# EAGLE design time_circuits1.3 (EAGLE 9.6.2)
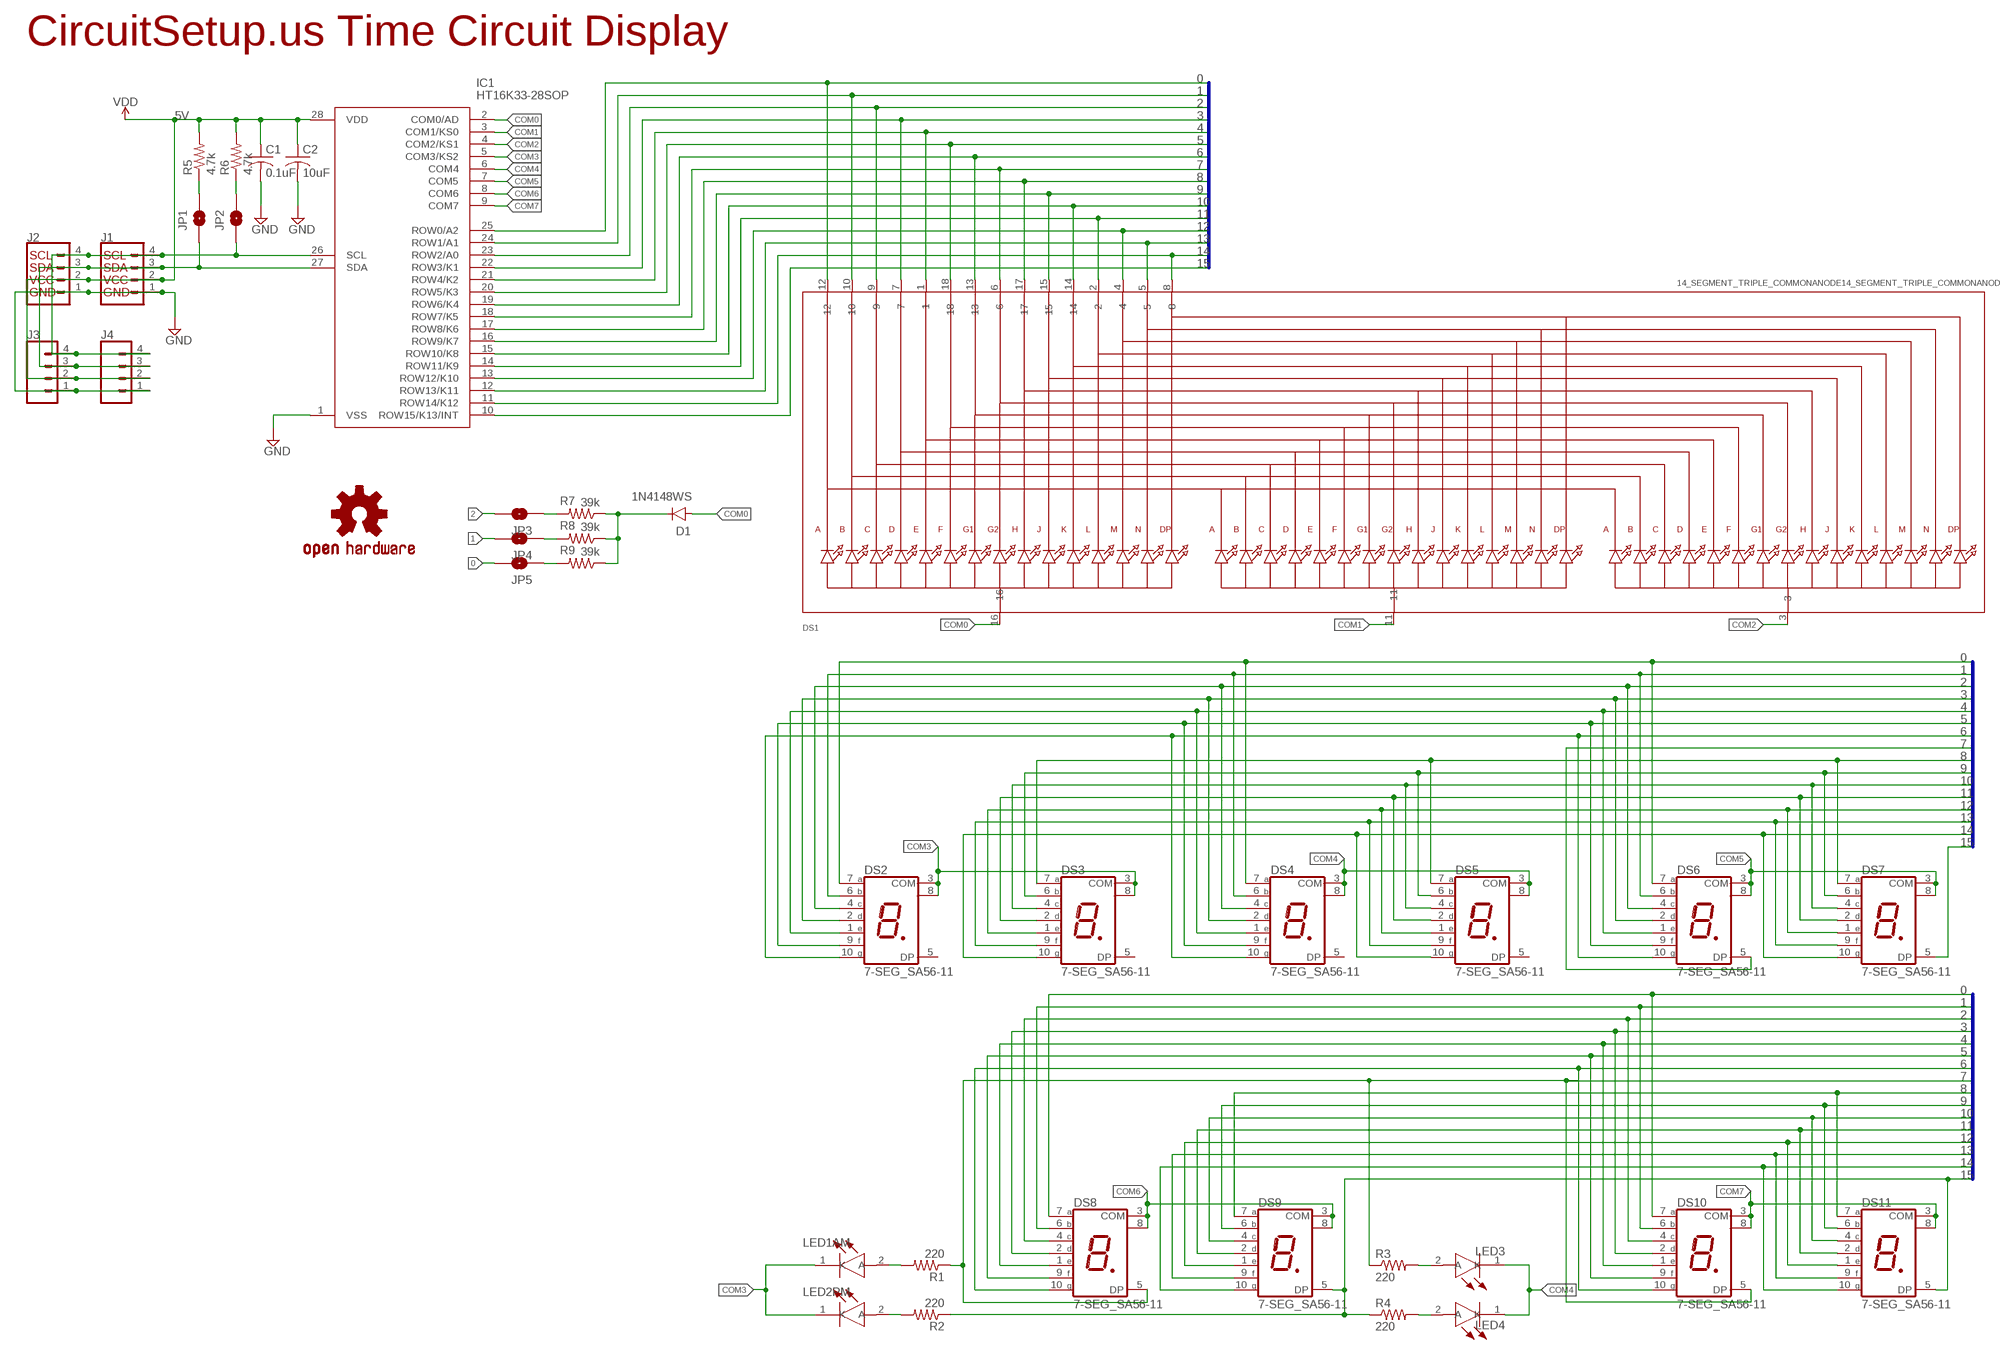
[diagram p0: schematic, sheet 1]

## Parts
C1  0.1uF  C-USC0603  [C0603]
C2  10uF  C-USC0603  [C0603]
D1  1N4148WS  [SOD-323]
DS1  14_SEGMENT_TRIPLE_COMMONANODE14_SEGMENT_TRIPLE_COMMONANODE  [SEGMENT_TRIPLE_14]
DS2  7-SEG_SA56-11  [SA56-11]
DS3  7-SEG_SA56-11  [SA56-11]
DS4  7-SEG_SA56-11  [SA56-11]
DS5  7-SEG_SA56-11  [SA56-11]
DS6  7-SEG_SA56-11  [SA56-11]
DS7  7-SEG_SA56-11  [SA56-11]
DS8  7-SEG_SA56-11  [SA56-11]
DS9  7-SEG_SA56-11  [SA56-11]
DS10  7-SEG_SA56-11  [SA56-11]
DS11  7-SEG_SA56-11  [SA56-11]
IC1  HT16K33-28SOP  [SOIC127P1031X264-28N]
J1  I2C_STANDARD  [1X04]
J2  I2C_STANDARD  [1X04]
J3  CONN_04SMD_2.54  [1X04_5.5MM_STRAIGHT]
J4  CONN_04SMD_2.54  [1X04_5.5MM_STRAIGHT]
JP1  JUMPER-SMT_2_NO_SILK  [SMT-JUMPER_2_NO_SILK]
JP2  JUMPER-SMT_2_NO_SILK  [SMT-JUMPER_2_NO_SILK]
JP3  JUMPER-SMT_2_NO_SILK  [SMT-JUMPER_2_NO_SILK]
JP4  JUMPER-SMT_2_NO_SILK  [SMT-JUMPER_2_NO_SILK]
JP5  JUMPER-SMT_2_NO_SILK  [SMT-JUMPER_2_NO_SILK]
LED1AM  WP132XGD  [WP132XGD]
LED2PM  WP132XGD  [WP132XGD]
LED3  WP132XGD  [WP132XGD]
LED4  WP132XGD  [WP132XGD]
LOGO1  OSHW-LOGOL  [OSHW-LOGO-L]
R1  220  R-US_R0603  [R0603]
R2  220  R-US_R0603  [R0603]
R3  220  R-US_R0603  [R0603]
R4  220  R-US_R0603  [R0603]
R5  4.7k  R-US_R0603  [R0603]
R6  4.7k  R-US_R0603  [R0603]
R7  39k  R-US_R0603  [R0603]
R8  39k  R-US_R0603  [R0603]
R9  39k  R-US_R0603  [R0603]

## Nets
0: DS1.12 DS2.7(A) DS4.7(A) DS6.7(A) DS8.7(A) DS10.7(A) IC1.25(ROW0/A2) JP5.2
1: DS1.10 DS2.6(B) DS4.6(B) DS6.6(B) DS8.6(B) DS10.6(B) IC1.24(ROW1/A1) JP4.2
2: DS1.9 DS2.4(C) DS4.4(C) DS6.4(C) DS8.4(C) DS10.4(C) IC1.23(ROW2/A0) JP3.2
3: DS1.7 DS2.2(D) DS4.2(D) DS6.2(D) DS8.2(D) DS10.2(D) IC1.22(ROW3/K1)
4: DS1.1 DS2.1(E) DS4.1(E) DS6.1(E) DS8.1(E) DS10.1(E) IC1.21(ROW4/K2)
5: DS1.18 DS2.9(F) DS4.9(F) DS6.9(F) DS8.9(F) DS10.9(F) IC1.20(ROW5/K3)
5V: C1.1 C2.1 IC1.28(VDD) J1.2 J2.2 J3.2 J4.2 R5.2 R6.2 ; supply symbol labelled VDD
6: DS1.13 DS2.10(G) DS4.10(G) DS6.10(G) DS8.10(G) DS10.10(G) IC1.19(ROW6/K4)
7: DS1.6 DS6.5(DP) DS8.5(DP) DS10.5(DP) IC1.18(ROW7/K5) R1.1 R3.1
8: DS1.17 DS3.7(A) DS5.7(A) DS7.7(A) DS9.7(A) DS11.7(A) IC1.17(ROW8/K6)
9: DS1.15 DS3.6(B) DS5.6(B) DS7.6(B) DS9.6(B) DS11.6(B) IC1.16(ROW9/K7)
10: DS1.14 DS3.4(C) DS5.4(C) DS7.4(C) DS9.4(C) DS11.4(C) IC1.15(ROW10/K8)
11: DS1.2 DS3.2(D) DS5.2(D) DS7.2(D) DS9.2(D) DS11.2(D) IC1.14(ROW11/K9)
12: DS1.4 DS3.1(E) DS5.1(E) DS7.1(E) DS9.1(E) DS11.1(E) IC1.13(ROW12/K10)
13: DS1.5 DS3.9(F) DS5.9(F) DS7.9(F) DS9.9(F) DS11.9(F) IC1.12(ROW13/K11)
14: DS1.8 DS3.10(G) DS5.10(G) DS7.10(G) DS9.10(G) DS11.10(G) IC1.11(ROW14/K12)
15: DS7.5(DP) DS9.5(DP) DS11.5(DP) IC1.10(ROW15/K13/INT) R2.1 R4.1
COM0: D1.A DS1.16 IC1.2(COM0/AD)
COM1: DS1.11 IC1.3(COM1/KS0)
COM2: DS1.3 IC1.4(COM2/KS1)
COM3: DS2.3(COM) DS2.8(COM) DS3.3(COM) DS3.8(COM) IC1.5(COM3/KS2) LED1AM.1(K) LED2PM.1(K)
COM4: DS4.3(COM) DS4.8(COM) DS5.3(COM) DS5.8(COM) IC1.6(COM4) LED3.1(K) LED4.1(K)
COM5: DS6.3(COM) DS6.8(COM) DS7.3(COM) DS7.8(COM) IC1.7(COM5)
COM6: DS8.3(COM) DS8.8(COM) DS9.3(COM) DS9.8(COM) IC1.8(COM6)
COM7: DS10.3(COM) DS10.8(COM) DS11.3(COM) DS11.8(COM) IC1.9(COM7)
GND: C1.2 C2.2 IC1.1(VSS) J1.1 J2.1 J3.1 J4.1
LED2: LED2PM.2(A) R2.2
N$3: JP1.2 R5.1
N$4: JP2.2 R6.1
N$7: JP3.1 R7.2
N$8: JP4.1 R8.2
N$9: JP5.1 R9.2
N$13: D1.C R7.1 R8.1 R9.1
N$16: LED3.2(A) R3.2
N$17: LED4.2(A) R4.2
N$19: LED1AM.2(A) R1.2
SCL: IC1.26(SCL) J1.4 J2.4 J3.4 J4.4 JP2.1
SDA: IC1.27(SDA) J1.3 J2.3 J3.3 J4.3 JP1.1
Unconnected: DS2.5(DP) DS3.5(DP) DS4.5(DP) DS5.5(DP)

## Buses
0,1,2,3,4,5,6,7,8,9,10,11,12,13,14,15

## Notes on the sheet
- CircuitSetup.us Time Circuit Display

## Library data of the parts
C1 C2 = rcl:C-US: CAPACITOR, American symbol; SPICEPREFIX: C
D1 = Diodes:1N4148WS: DIODE GEN PURP 75V 150MA SOD323F Manufacturer's datasheet <https://www.onsemi.com/pub/Collateral/1N914BWS-D.pdf>; CREATED_BY: PCBLayout.com; DIGIKEY_PART_NUMBER: 1N4148WSFSTR-ND; MANUFACTURER: Diodes Incorporated; MPN: 1N4148WS; PACKAGE: SOD-323
DS1 = microbuilder:14_SEGMENT_TRIPLE_COMMONANODE
DS2-DS11 = display-kingbright:7-SEG_: Kingbright 14.2mm (0.56 INCH) SINGLE DIGIT NUMERIC DUISPLAY Source: SA56-11EWA(Ver1189471036.pdf; OC_FARNELL: unknown; OC_NEWARK: unknown
IC1 = SamacSys_Parts:HT16K33-28SOP: Key-in LED Control Driver RAM I2C 28SOP Holtek HT16K33-28SOP, LED Driver 16-Segments, 5 V, 28-Pin SOP Source: Datasheet <http://uk.rs-online.com/web/p/products/8850765>; ARROW_PART_NUMBER: HT16K33-28SOP; DESCRIPTION: Key-in LED Control Driver RAM I2C 28SOP Holtek HT16K33-28SOP, LED Driver 16-Segments, 5 V, 28-Pin SOP; HEIGHT: 2.64mm; MANUFACTURER_NAME: Holtek; MANUFACTURER_PART_NUMBER: HT16K33-28SOP
J1 J2 = SparkFun-Connectors:I2C_STANDARD: SparkFun I2C Standard Pinout Header SparkFun has standardized on a pinout for all I2C based sensor breakouts. This pinout allows I2C boards to be plugged directly into the headers on Arduino Uno compatible boards, and to be daisy chained easily. Example SparkFun Products: SparkFun Atmospheric Sensor Breakout - BME280 <https://www.sparkfun.com/products/13676> SparkFun Altitude/Pressure Sensor Breakout - MPL3115A2 <https://www.sparkfun.com/products/11084> SparkFun TOF Range Finder Sensor - VL6180 <https://www.sparkfun.com/products/12785>
J3 J4 = SparkFun-Connectors:CONN_04: Multi connection point. Often used as Generic Header-pin footprint for 0.1 inch spaced/style header connections On any of the 0.1 inch spaced packages, you can populate with these: Break Away Headers - Straight <https://www.sparkfun.com/products/116> (PRT-00116) Break Away Male Headers - Right Angle <https://www.sparkfun.com/products/553> (PRT-00553) Female Headers <https://www.sparkfun.com/products/115> (PRT-00115) Break Away Headers - Machine Pin <https://www.sparkfun.com/products/117> (PRT-00117) Break Away Female Headers - Swiss Machine Pin <https://www.sparkfun.com/products/743> (PRT-00743) For SCREWTERMINALS and SPRING TERMINALS visit here: Screw Terimnals on SparkFun.com <https://www.sparkfun.com/search/results?term=Screw+Terminals> (5mm/3.5mm/2.54mm spacing) This device is also useful as a general connection point to wire up your design to another part of your project. Our various solder wires solder well into these plated through hole pads. Hook-Up Wire - Assortment (Stranded, 22 AWG) <https://www.sparkfun.com/products/11375> (PRT-11375) Hook-Up Wire - Assortment (Solid Core, 22 AWG) <https://www.sparkfun.com/products/11367> (PRT-11367) View the entire wire category on our website here <https://www.sparkfun.com/categories/141> Special notes: Molex polarized connector foot print use with SKU : PRT-08231 with associated crimp pins and housings. 1MM SMD Version SKU: PRT-10208
JP1-JP5 = SparkFun-Jumpers:JUMPER-SMT_2_NO: Normally open jumper This jumper has two pads in close proximity to each other. Apply solder to close the connection. Round pads are easier to solder for beginners, but are a lot larger. SparkFun Product that uses the round pads: SparkFun EL Sequencer <https://www.sparkfun.com/products/12781>
LED1AM LED2PM LED3 LED4 = SamacSys_Parts:WP132XGD: LED Uni-Color Green 565nm 2-Pin T-1 Bag Source: Datasheet <https://www.arrow.com/en/products/wp132xgd/kingbright>; ARROW_PART_NUMBER: WP132XGD; ARROW_PRICE-STOCK: https://www.arrow.com/en/products/wp132xgd/kingbright; DESCRIPTION: LED Uni-Color Green 565nm 2-Pin T-1 Bag; HEIGHT: mm; MANUFACTURER_NAME: Kingbright; MANUFACTURER_PART_NUMBER: WP132XGD; MOUSER_PART_NUMBER: 604-WP132XGD; MOUSER_PRICE-STOCK: https://www.mouser.com/Search/Refine.aspx?Keyword=604-WP132XGD
LOGO1 = SparkFun-Aesthetics:OSHW-LOGO: Open-Source Hardware (OSHW) Logo This logo indicates the piece of hardware it is found on incorporates a OSHW license and/or adheres to the definition of open source hardware found here: http://freedomdefined.org/OSHW
R1-R9 = rcl:R-US_: RESISTOR, American symbol; SPICEPREFIX: R

## Net classes
0 default: width 0.254 mm

## Board
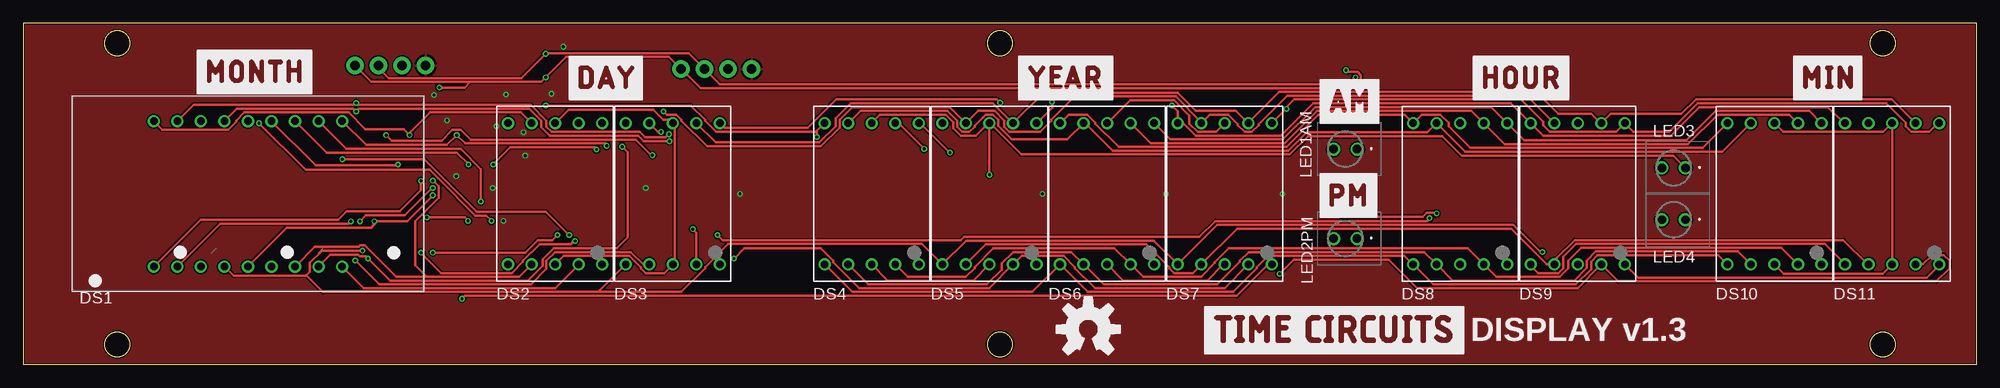
[diagram p1: board, top side]
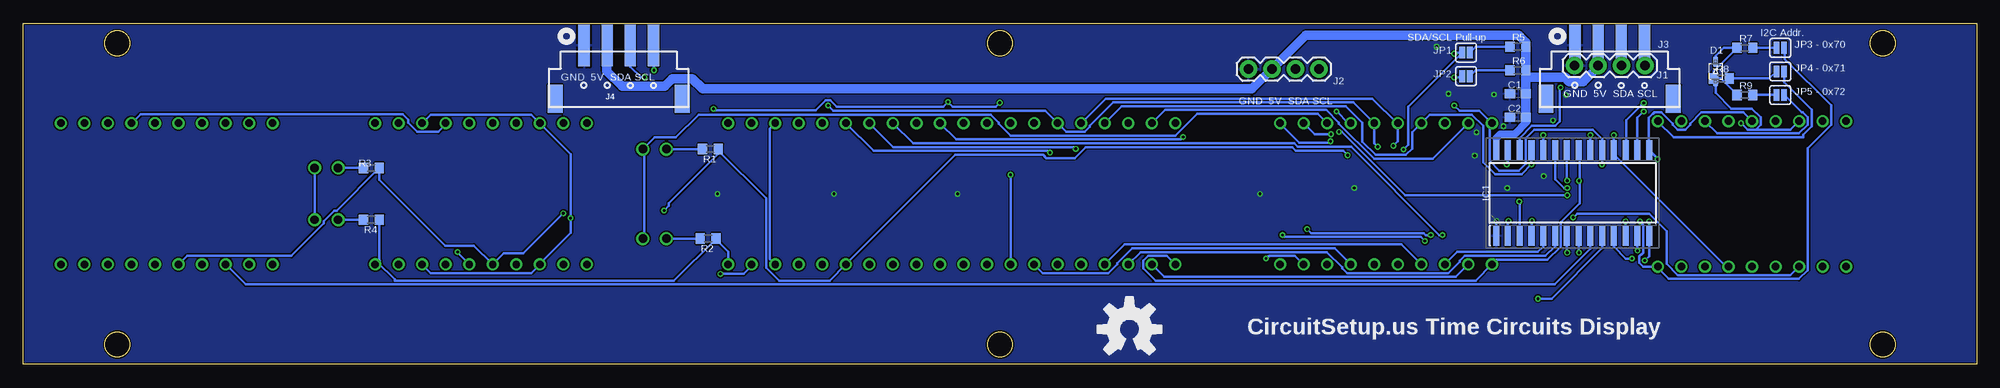
[diagram p2: board, bottom side, seen from below]

Size 210.82 x 36.83 mm. Coordinates in mm from the lower left corner, seen from the top.
Outline: 0,0 210.82,0 210.82,36.83 0,36.83 0,0
Outline: circle at 10.16,34.67 radius 1.35
Outline: circle at 10.16,2.16 radius 1.35
Outline: circle at 105.41,34.67 radius 1.35
Outline: circle at 105.41,2.16 radius 1.35
Outline: circle at 200.66,34.67 radius 1.35
Outline: circle at 200.66,2.16 radius 1.35
Copper layers (1*16): Top 0.035mm / dielectric 1.5mm / Bottom 0.035mm
Design rules "default *": minimum track width 5mil, minimum drill 0.3mm, track to track 6mil, track to pad 6mil, pad to pad 6mil, via to via 6mil, smd to smd 0mil, copper to edge 6mil, drill to drill 6mil, minimum pad ring 10mil, minimum via ring 6mil, stop-mask expansion 4mil, vias tented up to drill 25mil, thermal gap 10mil

### Footprints (pad centres in the part's own frame; a part is rotated, then mirrored left to right if it is on the bottom)
C0603 = smd 1.1 x 1: 1 -0.85,0; 2 0.85,0
SOD-323 = smd 1.14 x 0.52: A 1.04,0; C -1.04,0
SEGMENT_TRIPLE_14 = drill 0.8: 1 -10.16,-7.85; 2 -7.62,-7.85; 3 -5.08,-7.85; 4 -2.54,-7.85; 5 0,-7.85; 6 2.54,-7.85; 7 5.08,-7.85; 8 7.62,-7.85; 9 10.16,-7.85; 10 10.16,7.85; 11 7.62,7.85; 12 5.08,7.85; 13 2.54,7.85; 14 0,7.85; 15 -2.54,7.85; 16 -5.08,7.85; 17 -7.62,7.85; 18 -10.16,7.85
SA56-11 = drill 0.8: 1 -5.08,-7.62; 2 -2.54,-7.62; 3 0,-7.62; 4 2.54,-7.62; 5 5.08,-7.62; 6 5.08,7.62; 7 2.54,7.62; 8 0,7.62; 9 -2.54,7.62; 10 -5.08,7.62
SOIC127P1031X264-28N = smd 2.1 x 0.65: 1 -4.65,8.255; 2 -4.65,6.985; 3 -4.65,5.715; 4 -4.65,4.445; 5 -4.65,3.175; 6 -4.65,1.905; 7 -4.65,0.635; 8 -4.65,-0.635; 9 -4.65,-1.905; 10 -4.65,-3.175; 11 -4.65,-4.445; 12 -4.65,-5.715; 13 -4.65,-6.985; 14 -4.65,-8.255; 15 4.65,-8.255; 16 4.65,-6.985; 17 4.65,-5.715; 18 4.65,-4.445; 19 4.65,-3.175; 20 4.65,-1.905; 21 4.65,-0.635; 22 4.65,0.635; 23 4.65,1.905; 24 4.65,3.175; 25 4.65,4.445; 26 4.65,5.715; 27 4.65,6.985; 28 4.65,8.255
1X04 = drill 1.016 pad 1.88: 1 0,0; 2 2.54,0; 3 5.08,0; 4 7.62,0
1X04_5.5MM_STRAIGHT = smd 1.2 x 4.5: 1 -3.737,3.688; 2 -1.238,3.688; 3 1.262,3.688; 4 3.763,3.688 | smd 1.6 x 3: NC1 -6.862,-2.062; NC2 6.875,-2.062
SMT-JUMPER_2_NO_SILK = smd 0.635 x 1.27: 1 -0.406,0; 2 0.406,0
WP132XGD = drill 0.9 pad 1.4: 1 0,0; 2 0,-2.54
R0603 = smd 1 x 1.1: 1 -0.85,0; 2 0.85,0

### Placement (x,y rotation side)
C1  49.53,29.21 180 bottom
C2  49.53,26.67 180 bottom
D1  28.19,31.62 270 bottom
DS1  24.26,18.41 0 top
DS2  57.4,18.41 0 top
DS3  70.1,18.41 0 top
DS4  91.57,18.41 0 top
DS5  104.27,18.41 0 top
DS6  116.97,18.41 0 top
DS7  129.67,18.41 0 top
DS8  155.07,18.41 0 top
DS9  167.77,18.41 0 top
DS10  188.98,18.41 0 top
DS11  201.68,18.41 0 top
IC1  43.61,18.52 90 bottom
J1  43.43,32.26 0 bottom
J2  78.61,31.88 0 bottom
J3  39.62,30.73 0 bottom
J4  146.56,30.73 0 bottom
JP1  55.12,33.66 0 bottom
JP2  55.12,31.11 0 bottom
JP3  21.21,34.16 0 bottom
JP4  21.21,31.62 0 bottom
JP5  21.21,29.08 0 bottom
LED1AM  143.94,23.24 270 top
LED2PM  143.94,13.59 270 top
LED3  179.37,21.21 270 top
LED4  179.37,15.62 270 top
LOGO1  114.94,3.81 0 top
LOGO2  OSHW-LOGOL  [OSHW-LOGO-L]  91.44,3.81 0 bottom
R1  136.65,23.24 180 bottom
R2  136.91,13.59 180 bottom
R3  173.25,21.21 180 bottom
R4  173.25,15.62 180 bottom
R5  49.53,34.29 0 bottom
R6  49.53,31.75 0 bottom
R7  25.02,34.16 0 bottom
R8  27.56,30.86 0 bottom
R9  25.02,29.08 0 bottom
U$1  [MONTH]  18.8,29.21 0 top
U$2  [DAY]  58.93,28.57 0 top
U$3  [YEAR]  107.44,28.57 0 top
U$4  [HOUR]  156.49,28.57 0 top
U$5  [MIN]  191.06,28.57 0 top
U$6  [AM]  139.95,26.04 0 top
U$7  [PM]  139.95,15.88 0 top

### Tracks (layer width: path | path; a pad name or v marks a point on that pad's centre or on a via)
0  (via drill 0.3)
  Top 0.254: v97.23,23.27 94.46,26.04 DS4.7 | v48.06,21.59 46.78,22.86 32.74,22.86 DS1.12 | DS6.7 121.66,23.88 136.16,23.88 139.65,27.38 156.27,27.38 DS8.7 159.86,23.78 179.65,23.78 182.84,26.97 190.58,26.97 DS10.7
  Bottom 0.254: DS6.7 116.92,23.45 97.42,23.45 v97.23,23.27 | v97.23,23.27 | IC1.25 v48.06,21.59 49.12,20.52 51.95,20.52 53.24,21.82 53.24,25.74 54.48,26.97 59.01,26.97 DS2.7 60.94,25.04 60.94,23.3 61.63,22.61 64.86,22.61 66.29,24.04 66.29,26.09 68.1,27.89 92.25,27.89 DS4.7 | DS1.12 28,24.93 19.2,24.93 18.24,25.88 18.24,26.65 18.79,27.2 18.92,27.2 JP5.2
1  (via drill 0.3)
  Top 0.254: DS4.6 96.8,26.04 99.97,22.86 v100.03,22.86 | v62.97,23.6 62.71,23.85 47.68,23.85 v46.79,24.75 45.72,23.68 37,23.68 DS1.10 | DS6.6 123.79,24.29 135.92,24.29 139.41,27.78 158.4,27.78 DS8.6 162,24.19 179.45,24.19 182.64,27.38 192.72,27.38 DS10.6
  Bottom 0.254: JP4.2 20.8,30.43 17.84,27.46 17.84,25.71 18.75,24.8 18.75,24.52 32.72,24.52 34.42,26.21 DS1.10 | v100.03,22.86 100.13,22.86 100.31,23.04 119.05,23.04 DS6.6 | v62.97,23.6 62.48,24.08 DS2.6 62.56,26.04 65.22,28.7 93.98,28.7 DS4.6 | IC1.24 v46.79,24.75
2  (via drill 0.3)
  Top 0.254: DS1.9 36.75,8.24 57.41,8.24 59.94,10.77 DS2.4 | v36.35,15.45 36.98,16.08 41.17,16.08 44.15,19.05 v44.2,19.05 | DS10.4 189.71,12.6 168.15,12.6 166.73,11.18 166.73,10.38 165.81,9.46 158.95,9.46 DS8.4 155.86,12.54 130.09,12.54 128.6,11.05 128.6,10.95 127.11,9.46 120.85,9.46 DS6.4 117.76,12.54 104.69,12.54 102.66,10.51 102.66,10.41 101.71,9.46 95.47,9.46 94.13,10.79 DS4.4
  Bottom 0.254: v36.35,15.45 36.35,15.36 36.02,15.03 36.02,12.04 36.41,11.65 36.41,10.99 35.99,10.56 DS1.9 34.42,10.41 33.23,9.22 19.2,9.22 18.24,10.18 18.24,23.34 15.7,25.88 15.7,27.96 20.7,32.95 20.7,34.06 JP3.2 | IC1.23 45.52,19.98 44.53,19 44.2,19 v44.2,19.05 | DS2.4 62.1,12.95 91.95,12.95 DS4.4
3  (via drill 0.3)
  Top 0.254: DS2.2 53.52,9.46 43.56,9.46 | 43.56,9.46 40.28,9.46 36.87,12.87 36.39,12.87 36.22,12.7 31.47,12.7 DS1.7 | DS10.2 185.04,12.19 169.71,12.19 168.73,11.22 168.73,10.42 167.37,9.05 154.27,9.05 DS8.2 151.19,12.13 132.23,12.13 131.27,11.18 131.27,11.08 128.83,8.64 116.58,8.64 DS6.2 113.09,12.13 106.83,12.13 105.61,10.91 105.61,10.24 104,8.64 91.21,8.64 89.05,10.79 DS4.2 | v44.2,19.83 44.37,19.66 44.41,19.66 44.83,19.24 44.83,18 42.29,15.46 42.29,10.72 43.56,9.46
  Bottom 0.254: DS4.2 87.68,9.45 56.21,9.45 DS2.2 | IC1.22 44.25,19.88 v44.2,19.83
4  (via drill 0.3)
  Top 0.254: v42.93,19.81 42.93,18.82 40.62,16.51 34.9,16.51 34.01,15.62 19.15,15.62 DS1.1 | DS10.1 182.91,11.79 169.88,11.79 169.19,11.1 169.19,10.3 167.53,8.64 152.14,8.64 DS8.1 149.05,11.73 134.36,11.73 133.14,10.51 133.14,10.41 130.56,7.83 114.85,7.83 DS6.1 108.92,7.82 89.46,7.82 DS4.1
  Bottom 0.254: DS4.1 87.42,11.73 89.41,11.73 89.96,11.18 89.96,10.41 88.59,9.04 54.08,9.04 DS2.1 51.84,11.28 46.33,11.28 44.91,12.7 44.91,15.35 42.88,17.38 42.88,19.76 v42.93,19.81 42.88,19.86 42.88,23.07 IC1.21
5  (via drill 0.3)
  Top 0.254: DS4.9 90.37,27.38 99.74,27.38 100.79,26.32 100.79,25.65 101.34,25.1 102.11,25.1 102.66,25.65 102.66,25.75 103.61,26.7 | 103.61,26.7 103.88,26.97 104.65,26.97 105.2,26.42 105.2,25.75 106.66,24.29 112.68,24.29 DS6.9 114.61,26.04 117.57,23.07 136.51,23.07 138.49,25.04 151.54,25.04 DS8.9 155.59,22.97 183.37,22.97 DS10.9 | 103.61,26.7 | DS2.9 53.7,27.2 43.9,27.2 41.71,25 v41.71,24.75 41.08,25.38 36.94,25.38 35.12,27.2 23.87,27.2 22.99,26.32 22.99,26.21 22.1,25.33 15.03,25.33 DS1.18
  Bottom 0.254: DS2.9 54.89,26.04 58.72,22.2 65.05,22.2 68.83,25.98 68.83,26.09 70.22,27.48 87.59,27.48 DS4.9 | IC1.20 v41.71,24.75
5V
  Bottom 0.254: J3.2 40.89,34.39 J1.2
  Bottom 0.61: R5.2 48.68,30.99 | IC1.28 51.87,24.41
  Bottom 0.813: 51.87,24.41 51.43,24.84 49.89,24.84 48.54,26.19 48.54,26.53 C2.1
  Bottom 1.016: C2.1 C1.1 48.68,30.99 | 48.68,30.99 R6.2 R5.2 48.68,34.8 49.44,35.55 72.4,35.55 J2.2 78.22,29.73 137.51,29.73 138.61,30.83 140.76,30.83 141.56,30.02 146.19,30.02 147.83,31.66 147.83,33.78 147.83,34.39 J4.2 | 48.68,30.99 44.43,30.99 43.97,30.53 42.45,30.53 40.89,32.09 J1.2
6  (via drill 0.3)
  Top 0.254: v85.65,24.54 85.65,25.2 DS4.10 85.55,25.1 74.8,25.1 73.58,26.32 73.58,26.42 72.06,27.94 v56.39,27.94 | v40.44,21.59 40.44,21.49 31.57,21.49 DS1.13 | DS6.10 112.82,26.97 114.81,26.97 115.7,26.09 115.7,25.98 118.21,23.48 136.33,23.48 139.78,26.92 149.1,26.92 DS8.10 150.92,26.97 152.94,26.97 153.82,26.09 153.82,25.73 156.18,23.37 181.24,23.37 DS10.10
  Bottom 0.254: DS6.10 110.14,24.29 85.9,24.29 v85.65,24.54 | v56.39,27.94 55.82,27.38 53.67,27.38 52.33,26.04 DS2.10 52.58,25.78 52.58,21.98 51.53,20.93 49.41,20.93 48.69,21.65 48.69,24.42 47.78,25.33 41.47,25.33 40.44,24.3 v40.44,21.59 IC1.19
7  (via drill 0.3)
  Top 0.254: v152.53,16.31 152.45,16.38 151.49,16.38 151.05,15.95 142.34,15.95 141.68,16.61 v141.66,16.61 | v67.89,22.58 67.77,22.58 66.09,24.26 48.28,24.26 47.21,25.33 46.32,25.33 45.15,24.16 39.75,24.16 v39.17,24.75
  Bottom 0.254: v152.53,16.31 156.84,11.99 158.95,11.99 DS8.5 162.18,12.83 165.29,12.83 172.4,19.94 R3.1 177.01,16.6 177.24,16.6 178.39,15.46 178.39,15.21 181.88,11.73 193.12,11.73 DS10.5 | v39.17,24.75 IC1.18 39.17,22.67 27.07,10.56 DS1.6 | v141.66,16.61 141.15,17.12 141.15,17.39 135.8,22.73 R1.1 135.8,23.06 130.66,17.92 130.66,10.46 129.24,9.05 123.79,9.05 DS6.5 110.24,22.61 100.72,22.61 100.39,22.28 97.35,22.28 96.17,23.45 73.87,23.45 73.49,23.07 68.38,23.07 v67.89,22.58
8  (via drill 0.3)
  Top 0.254: DS1.17 18.38,28.01 35.94,28.01 | 35.94,28.01 v35.94,28.21 | v69.69,24.84 69.37,24.52 67.13,24.52 66.55,25.1 57.02,25.1 56.47,25.65 56.47,26.32 54.78,28.01 35.94,28.01 | DS11.7 201.62,28.63 180.52,28.63 178.94,27.05 171.32,27.05 DS9.7 170.23,26.04 169.22,27.05 165.66,27.05 163.3,29.41 135.55,29.41 132.21,26.06 DS7.7 130.87,27.38 126.55,27.38 124.59,29.34 110.11,29.34 DS5.7 106.78,26.04 104.63,28.19 89.28,28.19 87.69,26.59 87.69,25.73 85.92,23.95 74.72,23.95 DS3.7
  Bottom 0.254: v35.94,28.21 36.19,27.96 36.21,27.96 37.85,26.33 37.85,23.22 IC1.17 | v69.69,24.84 71.45,24.84 DS3.7
9  (via drill 0.3)
  Top 0.254: DS5.6 109.37,26.04 111.02,27.69 v111.02,28.32 | DS11.6 206.6,26.04 205.67,25.1 203.75,25.1 203.15,25.71 203.15,26.06 201.02,28.19 180.72,28.19 177.65,25.12 173.76,25.12 DS9.6 171.91,25.1 164.74,25.1 164.01,25.83 164.01,26.19 161.6,28.59 137.18,28.59 136.32,27.74 v136.32,27.58 136.3,27.58 DS7.6 | DS3.6 75.69,25.53 84.66,25.53 87.73,28.6 105.08,28.6 v105.44,28.25 | v69.76,24.09 66.99,24.09 66.38,24.7 56.85,24.7 55.93,25.61 55.93,26.29 54.62,27.6 36.24,27.6 v35.94,27.3 35.64,27.61 23.06,27.61 DS1.15
  Bottom 0.254: v35.94,27.3 36.63,26.62 IC1.16 | v69.76,24.09 69.91,23.93 73.13,23.93 75.18,25.98 DS3.6 | v105.44,28.25 105.89,27.79 110.49,27.79 v111.02,28.32 111.53,27.81 123,27.81 123.71,28.52 124.19,28.52 125.31,27.41 136.14,27.41 v136.32,27.58
10  (via drill 0.3)
  Top 0.254: v135.59,9.78 137.11,11.3 147.34,11.3 150.41,8.24 167.75,8.24 DS9.4 172.14,8.97 206.45,8.97 207.87,10.39 207.87,11.2 207.26,11.81 205.99,11.81 204.98,10.79 DS11.4 | v72.26,14.61 72.64,14.22 DS3.4 | v34.44,22.14 34.47,22.17 43.27,22.17 48.96,16.48 56.41,16.48 v58.93,13.97 | DS7.4 129.65,8.24 115.67,8.24 113.49,10.41 113.49,10.51 112.27,11.73 107.74,11.73 DS5.4 104.24,8.23 90.25,8.23 87.42,11.05 87.42,11.18 86.08,12.52 77.8,12.52 v76.71,11.43
  Bottom 0.254: IC1.15 34.44,22.25 v34.44,22.14 35.41,23.11 35.41,26.62 34.95,27.08 34.92,27.08 34.8,27.2 34.03,27.2 32.81,25.98 32.81,25.88 32.26,25.33 31.49,25.33 30.94,25.88 30.94,25.98 29.72,27.2 25.19,27.2 DS1.14 | DS7.4 132.21,10.64 133.07,9.78 v135.59,9.78 | v72.26,14.61 71.83,14.17 59.66,14.17 59.46,13.97 v58.93,13.97 | v76.71,11.43 76.45,11.68 76.38,11.68 76.33,11.73 73.58,11.73 DS3.4
11  (via drill 0.3)
  Top 0.254: DS1.2 21.27,15.19 35.1,15.19 v35.36,15.45 | DS3.2 67.56,10.74 66.97,10.74 65.58,12.13 57.42,12.13 56.47,11.18 56.47,10.3 54.81,8.64 38.41,8.64 v35.83,11.23 | DS11.2 199.03,10.79 196.42,13.41 167.42,13.41 165.51,11.5 165.51,11.07 DS9.2 164.41,10.79 160.55,14.66 131.01,14.66 127.15,10.79 DS7.2 126.19,9.86 124.2,9.86 123.65,10.41 123.65,10.51 121.21,12.95 103.88,12.95 DS5.2
  Bottom 0.254: v35.36,15.45 IC1.14 35.36,11.7 v35.83,11.23 | DS3.2 69.31,12.54 91.14,12.54 92.77,10.91 92.77,10.81 93.72,9.86 100.79,9.86 DS5.2
12  (via drill 0.3)
  Top 0.254: DS1.4 22.7,9.58 30.53,9.58 30.56,9.61 | 30.56,9.61 30.94,9.99 30.94,10.95 32.29,12.29 36.39,12.29 36.4,12.31 36.6,12.31 v36.63,12.29 | v163.93,12.14 163.7,12.14 160.77,15.07 128.87,15.07 DS7.1 122.03,13.35 101.75,13.35 DS5.1 96.98,13.01 76.07,13.01 73.58,10.51 73.58,10.41 71,7.83 62.23,7.83 | DS11.1 194.39,13.01 167.59,13.01 166.19,11.6 166.19,10.41 165.64,9.86 163.47,9.86 162.69,10.64 DS9.1 | 62.23,7.83 32.33,7.83 30.56,9.61 | DS3.1 62.23,8 62.23,7.83
  Bottom 0.254: IC1.13 v36.63,12.29 | v163.93,12.14 163.93,12.04 DS9.1
13  (via drill 0.3)
  Top 0.254: DS1.5 28.47,14.78 37.55,14.78 37.9,15.12 v37.9,15.45 41.43,15.45 44.2,18.21 v44.2,18.26 | v69.09,27.3 69.42,26.97 70.49,26.97 71.04,26.42 71.04,26.32 73.81,23.55 86.08,23.55 88.09,25.56 88.09,26.42 89.45,27.78 99.98,27.78 DS5.9 103.07,27.38 104.82,27.38 105.87,26.32 105.87,25.65 106.42,25.1 109.73,25.1 110.95,26.32 110.95,26.42 113.46,28.93 124.36,28.93 127.13,26.16 DS7.9 128.06,26.97 130.05,26.97 131.09,25.93 131.09,25.83 131.82,25.1 132.59,25.1 133.32,25.83 133.32,25.93 136.39,29 162.26,29 DS9.9 | DS3.9 68.5,25.1 v68.83,25.1
  Bottom 0.254: IC1.12 v37.9,15.45 | v68.83,25.1 68.53,25.1 61.69,18.26 v44.2,18.26 | DS11.9 199.11,26.04 198.15,26.99 169.84,26.99 169.27,26.42 169.27,26.07 168.31,25.1 166.01,25.1 165.23,25.88 DS9.9 | v69.09,27.3 67.82,26.04 DS3.9
14  (via drill 0.3)
  Top 0.254: DS1.8 31.88,10.62 33.12,11.85 36.15,11.85 36.35,11.66 36.98,11.66 v37.21,11.43 39.59,9.05 54.44,9.05 56.06,10.68 56.06,11.35 57.26,12.55 64.04,12.55 65.22,13.73 65.22,22.91 v64.64,23.5 | DS11.10 196.49,26.04 194.75,27.78 180.89,27.78 177.81,24.7 164.03,24.7 DS9.10 160.53,28.19 139.21,28.19 135.72,24.7 126.54,24.7 125.2,26.04 DS7.10 124.59,27.3 v123.95,27.94
  Bottom 0.254: v123.95,27.94 123.39,27.38 100.53,27.38 DS5.10 98.25,25.1 96.26,25.1 95.71,25.65 95.71,25.75 93.17,28.29 67.28,28.29 DS3.10 65.02,23.88 v64.64,23.5 | v37.21,11.43 37.87,11.43 39.17,12.73 IC1.11
15  (via drill 0.3)
  Top 0.254: v47.35,7.1 47.65,7.4 130.97,7.4 134.37,10.79 DS7.5 | DS11.5 206.76,10.69 205.44,9.37 174.27,9.37 DS9.5
  Bottom 0.254: R4.1 172.4,11.2 172.34,11.2 172.54,11 | 172.54,11 170.71,9.17 170.71,9.05 140.6,9.05 R2.1 136.06,13.46 134.75,12.15 DS7.5 | DS9.5 172.75,10.79 172.54,11 | v47.35,7.1 45.9,7.1 40.41,12.58 40.41,13.84 IC1.10
COM0  (via drill 0.3)
  Top 0.254: v50.55,15.49 49.98,16.06 48.79,16.06 44.78,20.07 43.85,21 30.48,21 v25.44,26.04
  Bottom 0.254: D1.A 28.19,29.31 26.49,27.61 24.28,27.61 23.32,26.65 23.32,25.88 23.87,25.33 | v50.55,15.49 50.43,15.38 50.6,15.21 IC1.2 | DS1.16 20.11,25.33 23.87,25.33 | v25.44,26.04 24.74,25.33 23.87,25.33
COM1  (via drill 0.3)
  Top 0.254: DS1.11 34.88,23.27 47.2,23.27 49.38,21.09 v49.38,17.58
  Bottom 0.254: v49.38,17.58 49.33,17.53 IC1.3
COM2  (via drill 0.3)
  Top 0.254: v43.56,15.88 47.62,15.88 v48.01,15.49
  Bottom 0.254: v48.01,15.49 48.01,13.92 IC1.4 | DS1.3 20.11,9.63 32.26,9.63 33.48,10.85 33.48,14.4 35.34,16.25 43.13,16.25 43.51,15.88 v43.56,15.88
COM3
  Top 0.254: DS2.3 58.34,11.73 65.41,11.73 66.63,10.51 66.63,10.41 67.18,9.86 69.17,9.86 DS3.3 70.34,11.03 70.34,25.8 DS3.8 69.72,26.42 69.08,26.42 67.99,27.5 58.87,27.5 DS2.8
  Bottom 0.254: IC1.5 46.81,13.84 46.81,12.7 47.37,12.14 56.06,12.14 DS2.3 | LED2PM.1 143.81,13.72 143.81,23.11 LED1AM.1 142.67,24.51 140.39,24.51 137.93,26.97 106.42,26.97 105.54,26.09 105.54,25.98 104.25,24.7 86.47,24.7 84.1,27.07 71.14,27.07 DS3.8
COM4  (via drill 0.3)
  Top 0.254: LED3.1 178.05,22.54 155.21,22.54 153.12,24.63 138.65,24.63 136.68,22.66 107.71,22.66 104.34,26.04 DS5.8 | DS5.8 v104.27,20.47 | DS4.8 91.57,26.09 92.45,26.97 99.57,26.97 100.39,26.16 100.39,25.48 101.17,24.7 102.82,24.7 104.16,26.04 DS5.8 | DS4.3 93.32,9.04 102.51,9.04 DS5.3
  Bottom 0.254: LED3.1 LED4.1 | v104.27,20.47 DS5.3 | DS4.3 90.23,12.13 70.12,12.13 68.5,10.51 68.5,10.41 67.95,9.86 57.02,9.86 55.8,11.08 55.8,11.18 55.25,11.73 46.55,11.73 45.52,12.76 IC1.6
COM5  (via drill 0.3)
  Top 0.254: v57.66,13.97 57.09,13.41 55.52,13.41 54.18,12.06 v44.2,12.06 | DS7.3 129.51,10.79 127.76,9.05 118.71,9.05 DS6.3 | DS6.8 119.45,28.52 124.19,28.52 125.86,26.86 125.86,25.98 126.74,25.1 128.73,25.1 DS7.8
  Bottom 0.254: DS6.8 114.79,23.86 73.68,23.86 73.3,23.48 67.5,23.48 58,13.97 v57.66,13.97 | v44.2,12.06 44.25,12.06 IC1.7 | DS7.8 130.25,25.45 130.25,11.38 DS7.3
COM6  (via drill 0.3)
  Top 0.254: v151.75,15.79 151.45,15.48 128.64,15.48 126.92,13.76 110.7,13.76 110.67,13.79 101.53,13.79 101.15,13.41 75.49,13.41 v74.93,13.97 | v59.56,13.34 59.44,13.34 59.08,12.98 55.73,12.98 53.93,11.18 53.93,11.08 52.71,9.86 45.13,9.86 v42.93,12.06
  Bottom 0.254: IC1.8 42.95,13.84 42.95,12.09 v42.93,12.06 | DS9.8 166.83,26.97 156,26.97 DS8.8 151.74,22.71 v151.74,15.8 v151.75,15.79 151.74,15.77 151.74,14.21 155.07,10.88 DS8.3 156,9.86 166.83,9.86 DS9.3 | v59.56,13.34 59.99,13.77 74.73,13.77 v74.93,13.97
COM7
  Top 0.254: DS10.8 189.91,25.1 200.74,25.1 DS11.8 DS11.3 200.67,9.79 189.99,9.79 DS10.3
  Bottom 0.254: DS10.3 186.82,8.64 45.53,8.64 41.71,12.46 IC1.9
GND  (via drill 0.3)
  Bottom 0.254: IC1.1 51.87,15.28 51.82,15.33 v51.82,15.49 | J3.1 43.43,34.35 J1.1
  other vias: 45.75,26.34 44.32,29.08 50.67,19.05 67.18,19.05 77.34,18.41 109.98,18.41 135.89,18.41 123.32,18.41 51.08,25.7 57.02,29.21 58.29,34.29 54,25.04 54.18,22.53 46.74,20.32 52.1,29.13
  pour Bottom: 214.63,38.1 -1.27,38.1 -1.27,-2.54 214.63,-2.54
  pour Top: -1.27,36.83 215.26,36.83 215.26,-3.81 -1.27,-3.81
LED2
  Bottom 0.254: R2.2 LED2PM.2
N$3
  Bottom 0.254: JP1.2 54.08,34.29 R5.1
N$4
  Bottom 0.254: JP2.2 54.08,31.75 R6.1
N$7
  Bottom 0.254: R7.2 JP3.1
N$8
  Bottom 0.254: R8.2 22.38,30.86 JP4.1
N$9
  Bottom 0.254: R9.2 JP5.1
N$13
  Bottom 0.254: D1.C 28.19,33.3 27.33,34.16 R7.1 28.41,31.62 R8.1 27.65,30.86 R9.1
N$16
  Bottom 0.254: LED3.2 R3.2
N$17
  Bottom 0.254: LED4.2 R4.2
N$19
  Bottom 0.254: R1.2 LED1AM.2
SCL  (via drill 0.3)
  Top 0.254: 48.26,30.5 55.91,30.5 v56.39,30.99 58.6,33.2 69.67,33.2 J2.4 71.05,31.88 73.1,29.82 143.42,29.82 144.35,30.75 144.35,31.23 144,31.57 142.93,31.57 v142.75,31.75 | 48.26,30.5 37.57,30.5 J1.4 | v44.91,29.88 47.63,29.88 48.26,30.5
  Bottom 0.254: JP2.1 55.65,30.99 v56.39,30.99 | IC1.26 49.33,24.44 48.01,25.76 45.5,25.76 45.03,26.23 45.03,29.75 v44.91,29.88 | v142.75,31.75 142.75,34.04 142.8,34.08 J4.4 | J3.4 35.86,32.31 J1.4
SDA  (via drill 0.3)
  Top 0.254: v61.87,23.19 61.62,23.44 52.58,23.44 v50.72,21.59 | J1.3 38.35,32 39.45,30.91 53.77,30.91 v56.39,33.53 56.46,33.6 71.81,33.6 J2.3 75.18,30.23 143,30.23 v143.76,30.99
  Bottom 0.254: v61.87,23.19 61.37,23.7 61.37,27.81 JP1.1 56.26,33.66 v56.39,33.53 | IC1.27 50.6,21.71 v50.72,21.59 | J3.3 J1.3 | J4.3 145.3,32.14 144.15,30.99 v143.76,30.99

### Text on the board
tPlace: DISPLAY v1.3
bPlace: I2C Addr. | SDA/SCL Pull-up | - 0x70 | - 0x71 | GND 5V SDA SCL | - 0x72 | GND 5V SDA SCL | GND 5V SDA SCL | CircuitSetup.us Time Circuits Display